# EAGLE design ATM90E26_Breakout (EAGLE 7.4.0)
CNAME: ATM90E26 Breakout; CREVISION: 0.1; DESIGNER: Tisham Dhar
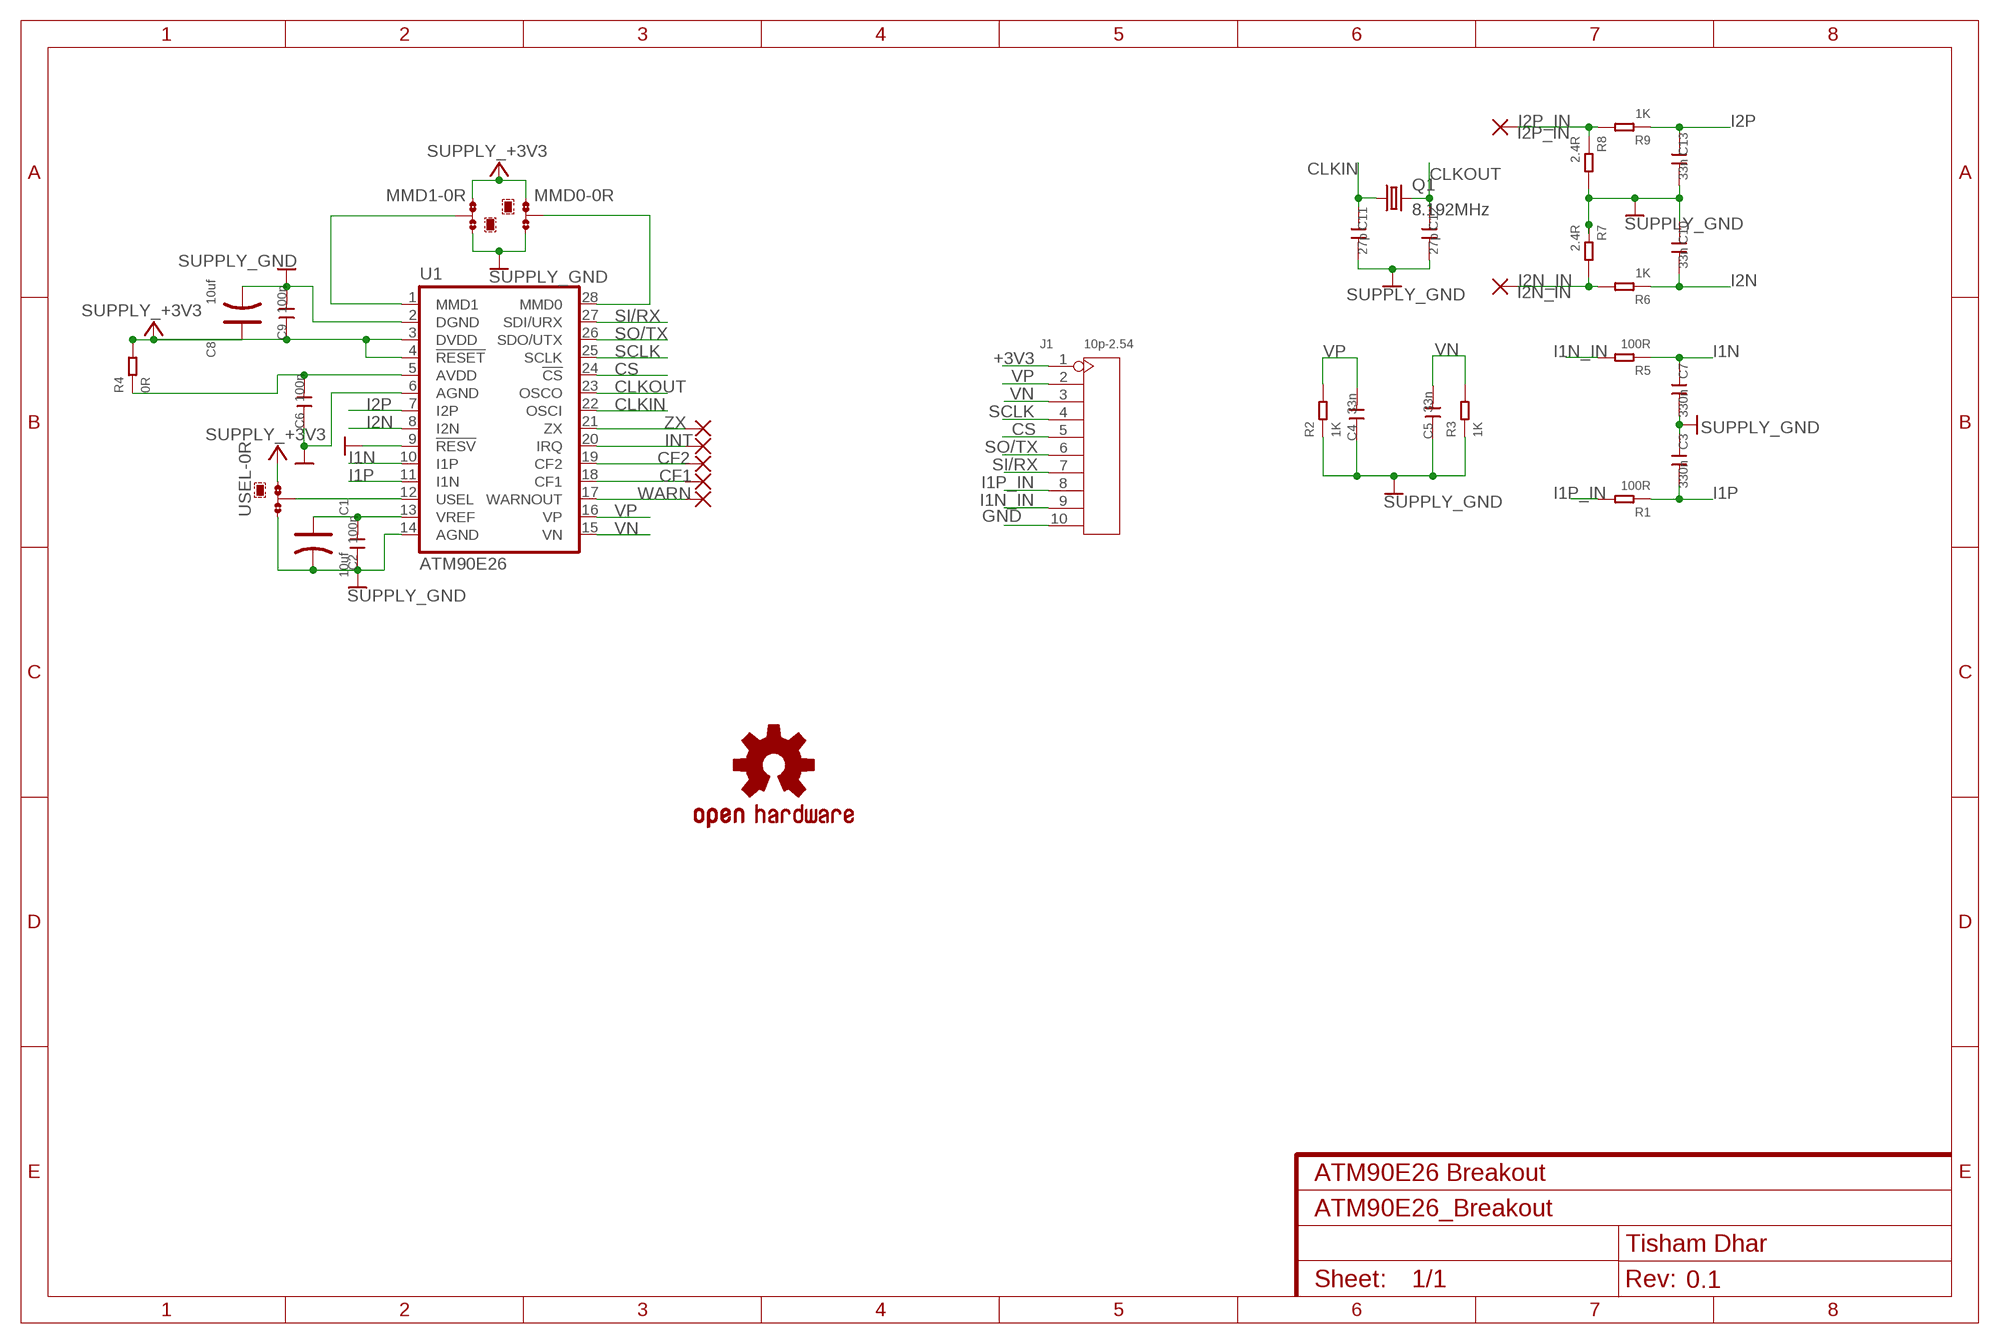
[diagram p0: schematic, sheet 1]

## Parts
C1  10uf  TANTALUM-SMD-22UF-10V(AVX-A)  [AVX-A]
C2  100n  C-0603  [C0603]
C3  330n  C-0603  [C0603]
C4  33n  C-0603  [C0603]
C5  33n  C-0603  [C0603]
C6  100n  C-0603  [C0603]
C7  330n  C-0603  [C0603]
C8  10uf  TANTALUM-SMD-22UF-10V(AVX-A)  [AVX-A]
C9  100n  C-0603  [C0603]
C10  33n  C-0603  [C0603]
C11  27p  C-0603  [C0603]
C12  27p  C-0603  [C0603]
C13  33n  C-0603  [C0603]
CF1  WIREPADSMD1,27-254  [SMD1,27-2,54]
CF2  WIREPADSMD1,27-254  [SMD1,27-2,54]
I2N_IN  WIREPADSMD1,27-254  [SMD1,27-2,54]
I2P_IN  WIREPADSMD1,27-254  [SMD1,27-2,54]
INT  WIREPADSMD1,27-254  [SMD1,27-2,54]
J1  10p-2.54  DIP-BLACK-MALE-HEADER-VERT(10P-2.54)  [H10-2.54]
LOGO1  OSHW-LOGOM  [OSHW-LOGO-M]
MMD0  0R-JUMPA  [A0R-JMP]
MMD1  0R-JUMPA  [A0R-JMP]
Q1  8.192MHz  CRYSTALHC49UP  [HC49UP]
R1  100R  SMD-RES-1K(0603)  [R0603]
R2  1K  SMD-RES-1K(0603)  [R0603]
R3  1K  SMD-RES-1K(0603)  [R0603]
R4  0R  SMD-RES-0R(0603)  [R0603]
R5  100R  SMD-RES-1K(0603)  [R0603]
R6  1K  SMD-RES-1K(0603)  [R0603]
R7  2.4R  SMD-RES-1K(0603)  [R0603]
R8  2.4R  SMD-RES-1K(0603)  [R0603]
R9  1K  SMD-RES-1K(0603)  [R0603]
U1  ATM90E26  [SSOP-28]
USEL  0R-JUMPA  [A0R-JMP]
WARN  WIREPADSMD1,27-254  [SMD1,27-2,54]
ZX  WIREPADSMD1,27-254  [SMD1,27-2,54]

## Nets
+3V3 [pwr]: C8.+ C9.1 J1.1 MMD0.1 MMD1.3 R4.2 U1.3(DVDD) U1.4(!RESET) USEL.1 ; supply symbol labelled SUPPLY_+3V3
CLKIN: C11.1 Q1.1 U1.22(OSCI)
CLKOUT: C12.1 Q1.2 U1.23(OSCO)
CS: J1.5 U1.24(!CS)
GND: C1.- C2.1 C3.1 C4.1 C5.1 C6.1 C7.2 C8.- C9.2 C10.1 C11.2 C12.2 C13.2 J1.10 MMD0.3 MMD1.1 R2.1 R3.1 R7.1 R8.2 U1.2(DGND) U1.6(AGND) U1.9(!RESV) U1.14(AGND) USEL.3 ; supply symbol labelled SUPPLY_GND
I1N: C7.1 R5.1 U1.10(I1P)
I1N_IN: J1.9 R5.2
I1P: C3.2 R1.1 U1.11(I1N)
I1P_IN: J1.8 R1.2
I2N: C10.2 R6.1 U1.8(I2N)
I2N_IN: I2N_IN.1(P) R6.2 R7.2
I2P: C13.1 R9.1 U1.7(I2P)
I2P_IN: I2P_IN.1(P) R8.1 R9.2
N$1: MMD1.2 U1.1(MMD1)
N$2: MMD0.2 U1.28(MMD0)
N$6 [pwr]: C6.2 R4.1 U1.5(AVDD)
N$11: CF1.1(P) U1.18(CF1)
N$12: CF2.1(P) U1.19(CF2)
N$15: U1.12(USEL) USEL.2
N$20: U1.21(ZX) ZX.1(P)
N$21: INT.1(P) U1.20(IRQ)
N$22: U1.17(WARNOUT) WARN.1(P)
SCLK: J1.4 U1.25(SCLK)
SI/RX: J1.7 U1.27(SDI/URX)
SO/TX: J1.6 U1.26(SDO/UTX)
VN: C5.2 J1.3 R3.2 U1.15(VN)
VP: C4.2 J1.2 R2.2 U1.16(VP)
VREF: C1.+ C2.2 U1.13(VREF)

## Library data of the parts
C1 C8 = Seeed-Capacitor-2016:TANTALUM-SMD-22UF-10V(AVX-A): 302020008; MPN: TAJA226*010#NJ; VALUE: 22uf
C2-C7 C9-C13 = Discrete:C*: Ceramic Capacitors
CF1 CF2 I2N_IN I2P_IN INT WARN ZX = wirepad:WIREPAD: Wire PAD connect wire on PCB
J1 = Seeed-OPL-Connector:DIP-BLACK-MALE-HEADER-VERT(10P-2.54): 320020050; MPN: P125-1110A0BS116AX
LOGO1 = SparkFun-Aesthetics:OSHW-LOGO: Open Source Hardware Logo This logo indicates the piece of hardware it is found on incorporates a OSHW license and/or adheres to the definition of open source hardware found here: http://freedomdefined.org/OSHW
MMD0 MMD1 USEL = jump-0r-smd:0R-JUMP: SMD 0R 0805 Jumper
Q1 = crystal:CRYSTAL: CRYSTAL; OC_FARNELL: unknown; OC_NEWARK: unknown
R1 R5 R7 R8 = Seeed-Resistor-2016:SMD-RES-1K(0603): 301010298; MPN: RC0603FR-071KL; VALUE: 1K
R2 R3 R6 R9 = Seeed-Resistor-2016:SMD-RES-1K(0603): 301010298; MPN: RC0603FR-071KL
R4 = Seeed-Resistor-2016:SMD-RES-0R(0603): 301010292; MPN: RC0603JR-070RL
U1 = ATM90E26:ATM90E26: Single-Phase High-Per formance Wide-Span Energy Metering IC

## Net classes
0 default: width 0.254 mm, drill 0.33 mm, clearance 0.152 mm
1 pwr: width 0.356 mm, drill 0.33 mm, clearance 0.254 mm

## Board
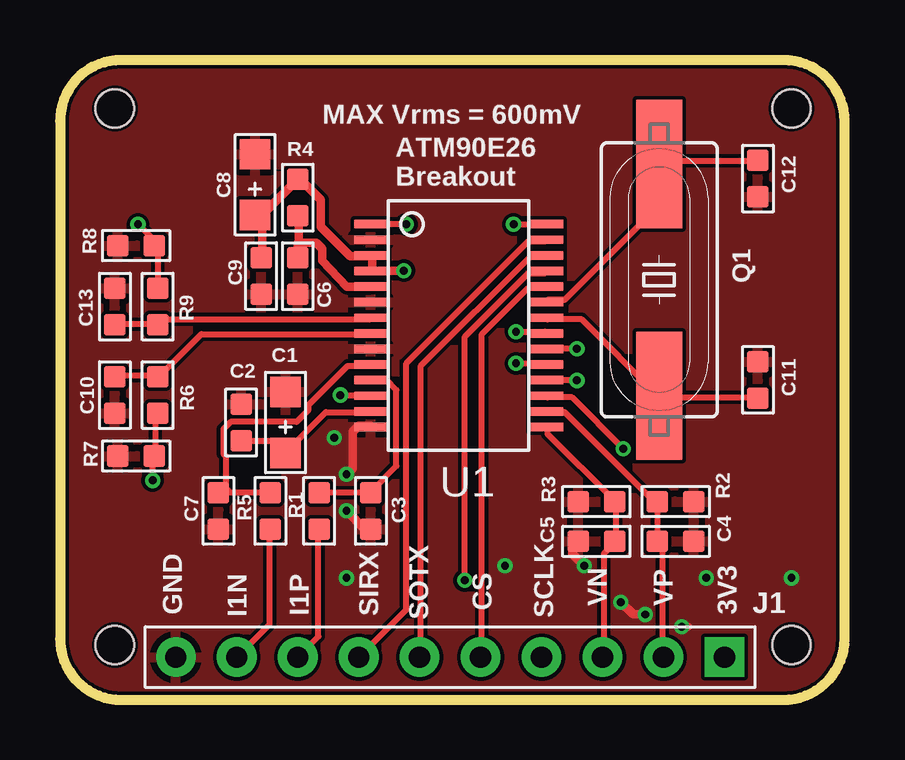
[diagram p1: board, top side]
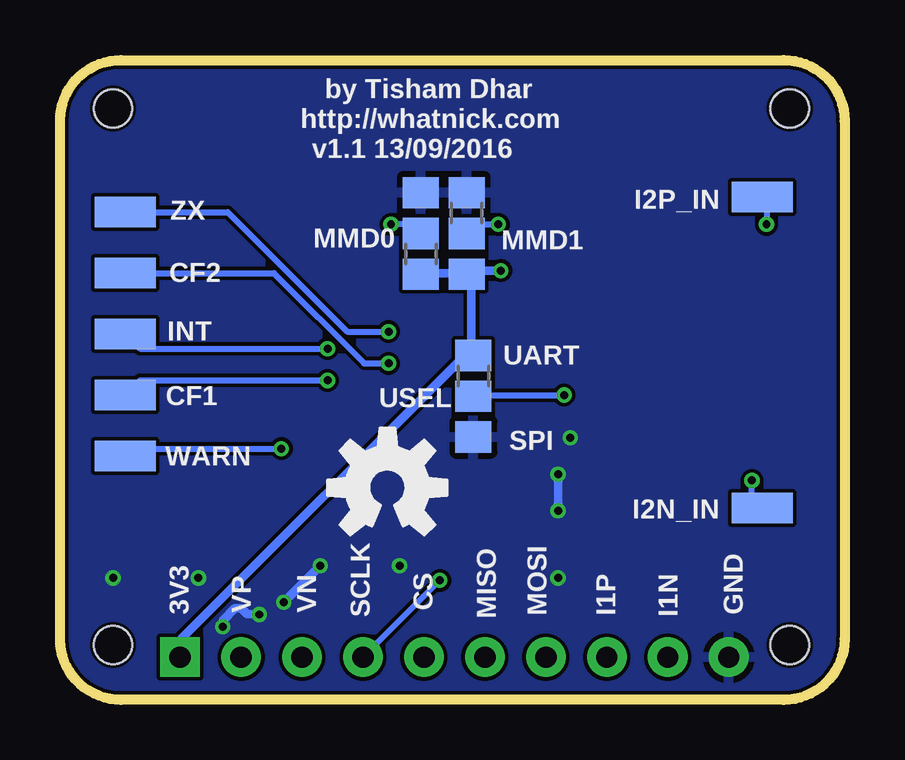
[diagram p2: board, bottom side, seen from below]

Size 32.69 x 26.66 mm. Coordinates in mm from the lower left corner, seen from the top.
Outline: 0,24.12 0,2.54 arc90 2.54,0 30.15,0 arc90 32.69,2.54 32.69,24.12 arc90 30.15,26.66 2.54,26.66 arc90 0,24.12
Copper layers (1*16): Top 0.035mm / dielectric 1.5mm / Bottom 0.035mm
Design rules "hackvana": minimum track width 6mil, minimum drill 0.3mm, track to track 6mil, track to pad 6mil, pad to pad 6mil, via to via 6mil, smd to smd 0mil, copper to edge 6mil, drill to drill 6mil, minimum pad ring 10mil, minimum via ring 6mil, stop-mask expansion 2mil, vias tented up to drill 100mil, thermal gap 10mil
Holes 1.6 mm at 2.29,24.64 30.48,24.64 2.29,2.29 30.48,2.29

### Footprints (pad centres in the part's own frame; a part is rotated, then mirrored left to right if it is on the bottom)
AVX-A = smd 1.27 x 1.27: + -1.27,0; - 1.27,0
C0603 = smd 0.889 x 0.889: 1 -0.762,0; 2 0.762,0
SMD1,27-2,54 = smd 1.27 x 2.54: 1 0,0
H10-2.54 = drill 0.889 pad 1.651 square: 1 0,11.43 | drill 0.889 pad 1.651: 2 0,8.89; 3 0,6.35; 4 0,3.81; 5 0,1.27; 6 0,-1.27; 7 0,-3.81; 8 0,-6.35; 9 0,-8.89; 10 0,-11.43
A0R-JMP = smd 1.5 x 1.3: 1 0,1.7; 2 0,0; 3 0,-1.7
HC49UP = smd 5.334 x 1.93: 1 -4.826,0; 2 4.826,0
R0603 = smd 0.889 x 0.889: 1 0,0.762; 2 0,-0.762
SSOP-28 = smd 0.348 x 1.397: 1 -4.225,-3.656; 2 -3.575,-3.656; 3 -2.925,-3.656; 4 -2.275,-3.656; 5 -1.625,-3.656; 6 -0.975,-3.656; 7 -0.325,-3.656; 8 0.325,-3.656; 9 0.975,-3.656; 10 1.625,-3.656; 11 2.275,-3.656; 12 2.925,-3.656; 13 3.575,-3.656; 14 4.225,-3.656; 15 4.225,3.656; 16 3.575,3.656; 17 2.925,3.656; 18 2.275,3.656; 19 1.625,3.656; 20 0.975,3.656; 21 0.325,3.656; 22 -0.325,3.656; 23 -0.975,3.656; 24 -1.625,3.656; 25 -2.275,3.656; 26 -2.925,3.656; 27 -3.575,3.656; 28 -4.225,3.656

### Placement (x,y rotation side)
C1  9.4,11.56 90 top
C2  7.54,11.56 270 top
C3  12.95,7.87 90 top
C4  25.65,6.6 180 top
C5  22.35,6.6 0 top
C6  9.91,17.65 90 top
C7  6.6,7.87 270 top
C8  8.13,21.46 90 top
C9  8.38,17.65 270 top
C10  2.29,12.7 90 top
C11  29.08,13.34 90 top
C12  29.08,21.72 270 top
C13  2.29,16.38 90 top
CF1  29.97,12.7 90 bottom
CF2  29.97,17.78 270 bottom
I2N_IN  3.43,8 270 bottom
I2P_IN  3.43,20.95 270 bottom
INT  29.97,15.24 270 bottom
J1  16.26,1.78 270 top
LOGO1  19.05,8.84 0 bottom
MMD0  17.65,19.43 180 bottom
MMD1  15.75,19.43 0 bottom
Q1  24.97,17.5 90 top
R1  10.8,7.87 0 top
R2  25.65,8.26 270 top
R3  22.35,8.26 90 top
R4  9.91,20.93 180 top
R5  8.76,7.87 0 top
R6  4.06,12.7 0 top
R7  3.17,10.16 90 top
R8  3.17,18.92 270 top
R9  4.06,16.38 180 top
U1  16.61,15.6 270 top
USEL  15.47,12.65 0 bottom
WARN  29.97,10.16 270 bottom
ZX  29.97,20.32 270 bottom

### Tracks (layer width: path | path; a pad name or v marks a point on that pad's centre or on a via)
+3V3  (via drill 0.33)
  Top 0.356: C9.1 8.43,19 8.43,20.12 C8.+ 8.43,20.22 R4.2 10.06,21.64 10.87,20.83 10.87,19.71 12.09,18.49 12.8,18.49 U1.3 13,18.49 13,17.88 U1.4 13.11,17.88 v14.33,17.88
  Bottom 0.356: MMD1.3 15.75,17.78 15.55,17.58 15.55,14.43 USEL.1 15.65,14.53 27.64,2.54 27.64,1.83 J1.1 | MMD0.1 17.48,17.78 15.95,17.78 MMD1.3 | v14.33,17.88 15.24,17.88 15.44,17.68 MMD1.3
CLKIN
  Top 0.254: C11.1 29.06,12.6 24.99,12.6 Q1.1 24.89,12.7 21.74,15.85 20.32,15.85 U1.22
CLKOUT
  Top 0.254: C12.1 29.06,22.45 25.1,22.45 Q1.2 24.89,22.25 24.89,20.52 21.03,16.66 20.32,16.66 U1.23
CS
  Top 0.254: U1.24 20.22,17.17 19.51,17.17 17.58,15.24 17.58,1.83 J1.5
GND  (via drill 0.33)
  Top 0.356: v24.38,3.56 23.88,3.56 v23.37,4.06 | v21.84,5.59 21.34,6.1 21.34,6.35 C5.1 | v25.91,3.05 26.16,3.05 | U1.14 12.95,11.43 12.45,11.43 12.19,11.18 12.19,9.65 v11.94,9.4 | v11.94,7.87 12.7,7.11 C3.1
  Bottom 0.356: v25.91,3.05 25.91,3.3 25.4,3.81 25.15,3.81 24.89,3.56 v24.38,3.56 | v21.84,5.59 v23.37,4.06 | v11.94,7.87 v11.94,9.4
  other vias: 11.94,5.08 11.43,10.92 18.54,5.59 30.48,5.08 26.92,5.08
  pour Top: 0,26.67 33.02,26.67 33.02,0 0,0
  pour Bottom: 0,26.67 33.02,26.67 33.02,0 0,0
I1N
  Top 0.254: R5.1 C7.1 | U1.10 12.9,13.92 11.99,13.92 10.36,12.29 10.36,12.09 9.86,11.58 7.11,11.58 6.81,11.28 6.81,10.26 6.91,10.16 6.91,8.84 C7.1 | 7.01,8.74 C7.1
I1N_IN
  Top 0.254: J1.9 8.74,3.15 8.74,7.11 R5.2
I1P
  Top 0.254: R1.1 C3.2 13,8.74 14.02,9.75 14.02,12.9 13.61,13.31 13,13.31 U1.11
I1P_IN
  Top 0.254: J1.8 10.77,2.64 10.77,7.11 R1.2
I2N
  Top 0.254: C10.2 2.34,13.51 4.06,13.51 R6.1 4.17,13.51 5.89,15.24 12.9,15.24 U1.8
I2N_IN  (via drill 0.33)
  Top 0.254: R6.2 4.06,11.89 3.96,11.79 3.96,10.16 R7.2 3.86,10.06 v3.86,9.14
  Bottom 0.254: v3.86,9.14 3.86,8.43 I2N_IN.1
I2P
  Top 0.254: C13.1 2.34,15.65 4.06,15.65 R9.1 4.17,15.65 4.37,15.85 12.9,15.85 U1.7
I2P_IN  (via drill 0.33)
  Top 0.254: R9.2 4.06,18.8 R8.1 3.86,19 3.86,19.2 v3.25,19.81
  Bottom 0.254: v3.25,19.81 3.25,20.83 3.35,20.93 I2P_IN.1
N$1  (via drill 0.33)
  Top 0.254: v14.43,19.81 13,19.81 U1.1
  Bottom 0.254: v14.43,19.81 15.44,19.81 MMD1.2
N$2  (via drill 0.33)
  Top 0.254: v18.9,19.81 20.22,19.81 U1.28
  Bottom 0.254: v18.9,19.81 17.88,19.81 17.58,19.51 MMD0.2
N$6
  Top 0.356: R4.1 9.96,20.12 9.96,19 C6.2 9.91,19.05 10.67,19.05 10.92,18.8 10.92,18.29 11.94,17.22 U1.5 | U1.5
N$11  (via drill 0.33)
  Top 0.254: v21.54,13.31 20.32,13.31 U1.18
  Bottom 0.254: v21.54,13.31 29.36,13.31 CF1.1
N$12  (via drill 0.33)
  Top 0.254: v19,14.02 20.22,14.02 U1.19
  Bottom 0.254: v19,14.02 20.02,14.02 23.77,17.78 CF2.1
N$15  (via drill 0.33)
  Top 0.254: v11.68,12.7 12.9,12.7 U1.12
  Bottom 0.254: v11.68,12.7 15.44,12.7 USEL.2
N$20  (via drill 0.33)
  Top 0.254: v19,15.34 20.22,15.34 U1.21
  Bottom 0.254: v19,15.34 20.73,15.34 25.71,20.32 ZX.1
N$21  (via drill 0.33)
  Top 0.254: v21.54,14.63 20.32,14.63 U1.20
  Bottom 0.254: v21.54,14.63 29.36,14.63 INT.1
N$22  (via drill 0.33)
  Top 0.254: v23.47,10.46 21.34,12.6 20.32,12.6 U1.17
  Bottom 0.254: v23.47,10.46 29.67,10.46 WARN.1
SCLK  (via drill 0.33)
  Top 0.254: v16.87,4.98 16.87,15.14 19.51,17.78 20.22,17.78 U1.25
  Bottom 0.254: J1.4 v16.87,4.98
SI/RX
  Top 0.254: J1.7 14.43,3.76 14.43,14.02 19.51,19.1 20.22,19.1 U1.27
SO/TX
  Top 0.254: U1.26 20.22,18.49 19.61,18.49 15.04,13.92 15.04,1.83 J1.6
VN
  Top 0.254: U1.15 20.32,11.28 20.32,11.07 23.06,8.33 R3.2 23.16,8.23 23.16,6.6 C5.2 23.06,6.5 22.66,6.1 22.66,1.83 J1.3
VP
  Top 0.254: U1.16 20.32,11.99 21.03,11.99 24.79,8.23 R2.2 C4.2 24.89,6.5 25.1,6.3 25.1,1.83 J1.2
VREF
  Top 0.254: C2.2 7.82,10.77 8.94,10.77 9.35,10.36 C1.+ 9.45,10.36 11.07,11.99 12.9,11.99 U1.13

### Text on the board
tPlace: MAX Vrms = 600mV | ATM90E26 / Breakout
bPlace: by Tisham Dhar | http://whatnick.com | v1.1 13/09/2016 | UART | SPI | GND | I1P | MOSI | CS | VN | VP | 3V3 | I1N | MISO | SCLK
tNames: GND | I1P | SIRX | CS | VN | VP | 3V3 | I1N | SOTX | SCLK